# Altium schematic sheet Sheet1.SchDoc
size A4
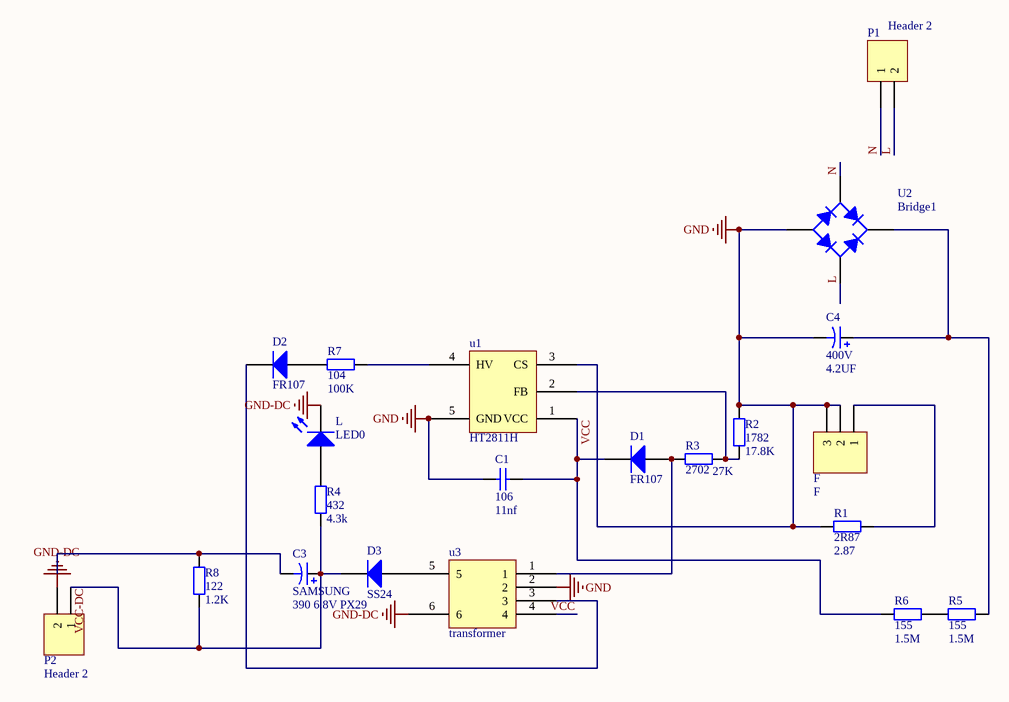
[diagram p0: Sheet1.SchDoc]

## Parts
C1  106  value 11nf  [RAD-0.3]
C3  SAMSUNG  value 390 6.8V PX29  [RB7.6-15]
C4  400V  value 4.2UF  [RB7.6-15]
D1  FR107  [LC-SOD-123F]
D2  FR107  [LC-SOD-123F]
D3  SS24  [LC-SMA(DO-214AC)_S1]
F  F  [HDR1X3]
L  LED0  [LED-0]
P1  Header 2  [HDR1X2]
P2  Header 2  [HDR1X2]
R1  2R87  value 2.87  [AXIAL-0.4]
R2  1782  value 17.8K  [AXIAL-0.4]
R3  2702  value 27K  [AXIAL-0.4]
R4  432  value 4.3k  [AXIAL-0.4]
R5  155  value 1.5M  [AXIAL-0.4]
R6  155  value 1.5M  [AXIAL-0.4]
R7  104  value 100K  [AXIAL-0.4]
R8  122  value 1.2K  [AXIAL-0.4]
u1  HT2811H
U2  Bridge1  [E-BIP-P4/D10]
u3  transformer

## Nets
GND: C1.1 C4.2 F.2 F.3 R1.1 R2.2 u1.3(CS) u1.5(GND) U2.3(A) u3.2
GND-DC: L.2(K) P2.2 u3.6
L: P1.2 U2.2(C)
N: P1.1 U2.4(C)
VCC: C1.2 D1.2(K) R6.1 u1.1(VCC)
VCC-DC: C3.1 D3.2(K) P2.1 R4.1 R8.2
NetC3_2: C3.2 R8.1
NetC4_1: C4.1 R5.2 U2.1(K)
NetD1_1: D1.1(A) R3.2 u3.1
NetD2_1: D2.1(A) R7.1
NetD2_2: D2.2(K) u3.3
NetD3_1: D3.1(A) u3.5
NetF_1: F.1 R1.2
NetL_1: L.1(A) R4.2
NetR2_1: R2.1 R3.1 u1.2(FB)
NetR5_1: R5.1 R6.2
NetR7_2: R7.2 u1.4(HV)

Not connected (* = marked no-connect by the designer): u3 4

## Notes on the sheet
- Labels drawn without touching a wire or pin: VCC

## Library data of the parts
C1 = Cap: Capacitor; Published: 8-Jun-2000; LatestRevisionDate: 17-Jul-2002; LatestRevisionNote: Re-released for DXP Platform.; PackageReference: RAD-0.3; Publisher: Altium Limited
C3 C4 = Cap Pol1: Polarized Capacitor (Radial); Published: 8-Jun-2000; LatestRevisionDate: 17-Jul-2002; LatestRevisionNote: Re-released for DXP Platform.; PackageReference: RB7.6-15; Publisher: Altium Limited
D1 D2 = Diode 1N4005: 1 Amp General Purpose Rectifier; Published: 8-Jun-2000; LatestRevisionDate: 17-Jul-2002; LatestRevisionNote: Re-released for DXP Platform.; DatasheetVersion: 1998; PackageVersion: Aug-1999; PackageReference: DO-41; Publisher: Altium Limited; Code_JEDEC: DO-204-AL; ComponentLink1Description: Manufacturer Link; ComponentLink1URL: http://www.fairchildsemi.com/; ComponentLink2Description: Datasheet; ComponentLink2URL: http://www.fairchildsemi.com/ds/1N%2F1N4001.pdf
D3 = Diode 1N4150: High Conductance Ultra Fast Diode; Published: 8-Jun-2000; LatestRevisionDate: 17-Jul-2002; LatestRevisionNote: Re-released for DXP Platform.; DatasheetVersion: 1997; PackageReference: DO-35; Publisher: Altium Limited; Code_JEDEC: DO-204-AH; ComponentLink1Description: Manufacturer Link; ComponentLink1URL: http://www.fairchildsemi.com/
F = Header 3: Header, 3-Pin; LatestRevisionDate: 17-Jul-2002; LatestRevisionNote: Re-released for DXP Platform.; Publisher: Altium Limited
L = LED0: Typical INFRARED GaAs LED; Published: 8-Jun-2000; LatestRevisionDate: 08-Jul-2005; LatestRevisionNote: Mech Layer 1 removed.; PackageReference: LED-0; Publisher: Altium Limited
P1 P2 = Header 2: Header, 2-Pin; LatestRevisionDate: 17-Jul-2002; LatestRevisionNote: Re-released for DXP Platform.; Publisher: Altium Limited
R1-R8 = Res2: Resistor; Published: 8-Jun-2000; LatestRevisionDate: 17-Jul-2002; LatestRevisionNote: Re-released for DXP Platform.; PackageReference: AXIAL-0.4; Publisher: Altium Limited
U2 = Bridge1: Full Wave Diode Bridge; Published: 8-Jun-2000; LatestRevisionDate: 29-May-2009; LatestRevisionNote: Sch pins A & K swapped.; DatasheetVersion: E2732B; PackageReference: D-38; Publisher: Altium Limited